# EAGLE design R151D (EAGLE 6.6.0)
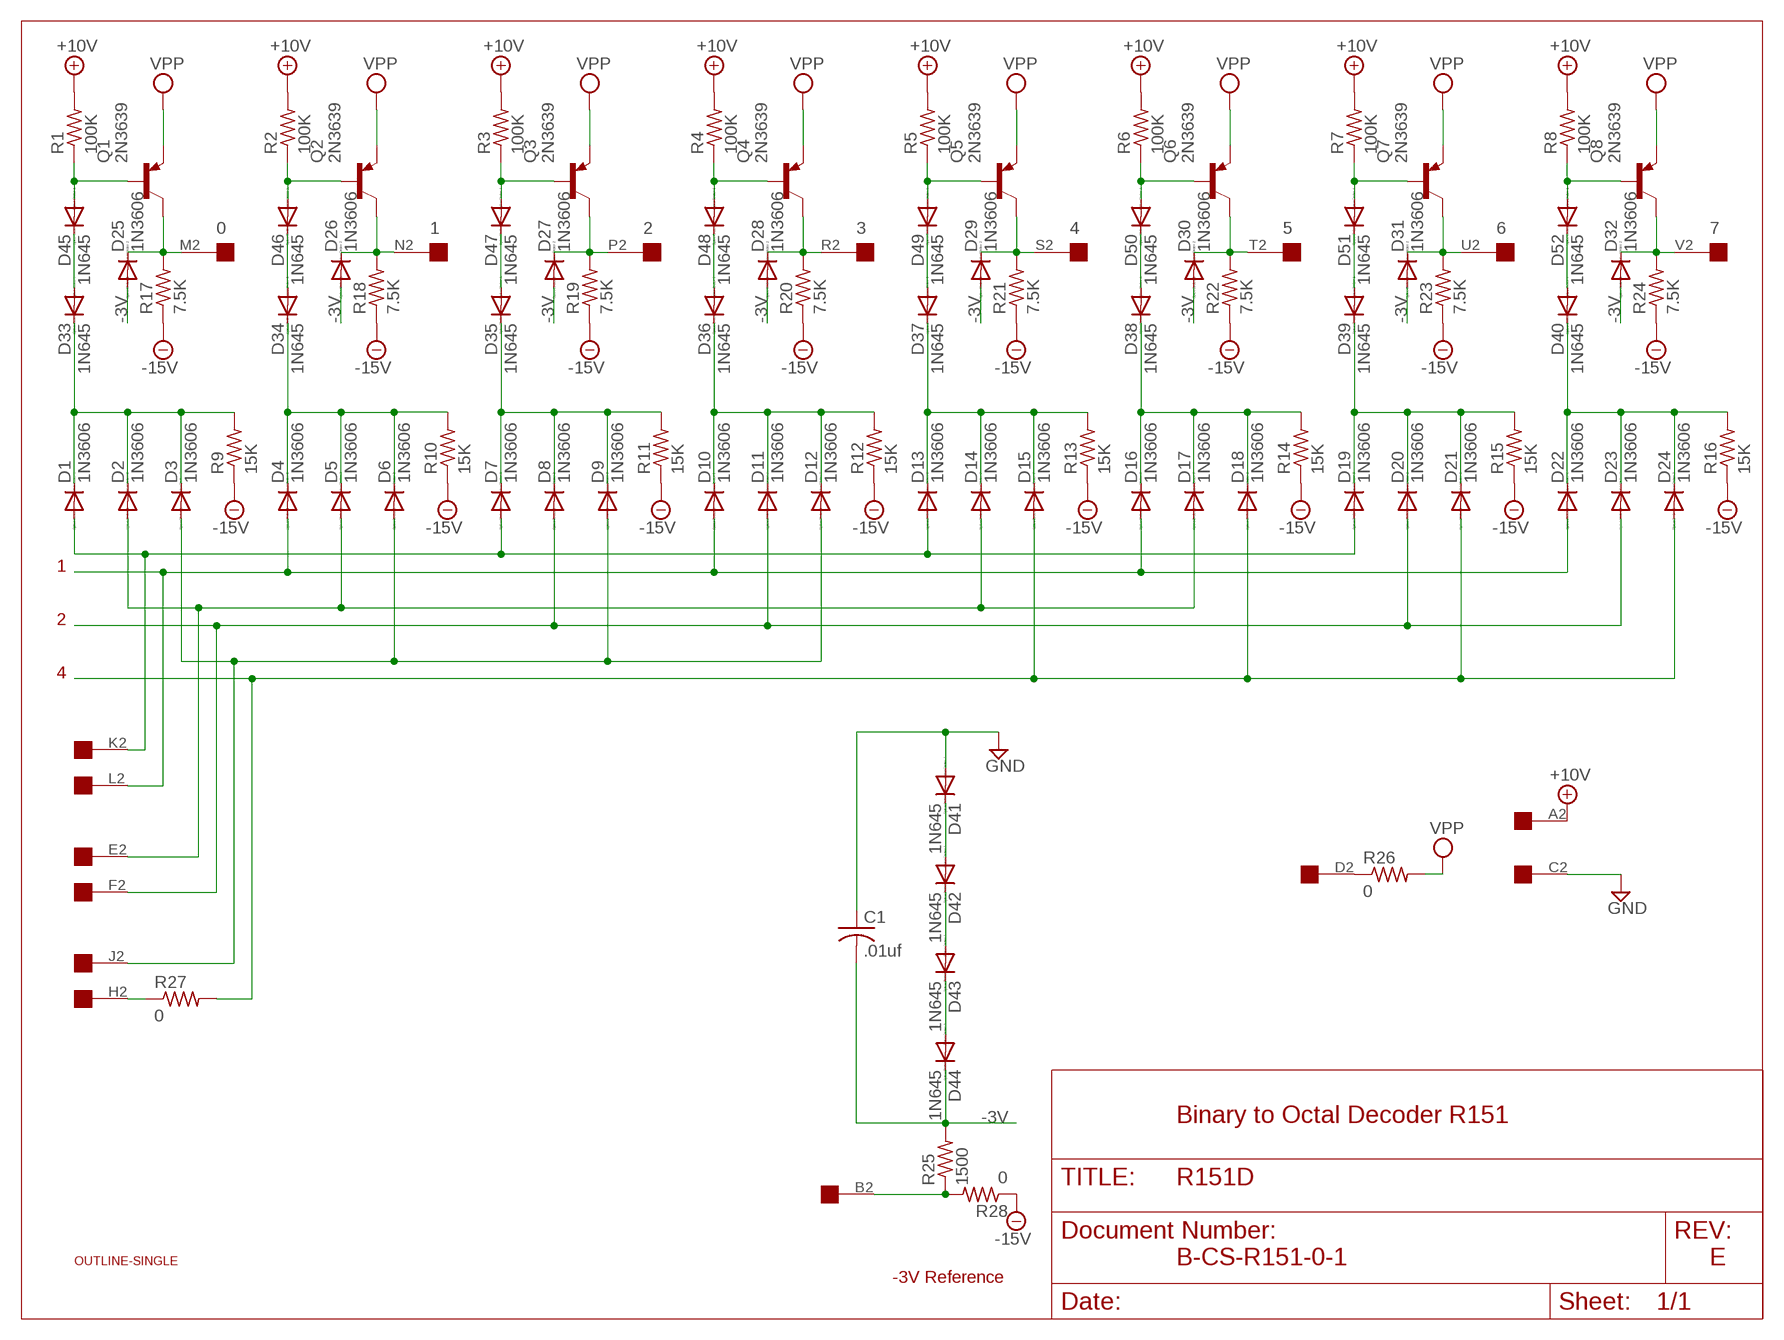
[diagram p0: schematic, sheet 1]

## Parts
C1  .01uf  C-US050-025X075  [C050-025X075]
D1  1N3606  1N4148DO35-10  [DO35-10]
D2  1N3606  1N4148DO35-10  [DO35-10]
D3  1N3606  1N4148DO35-10  [DO35-10]
D4  1N3606  1N4148DO35-10  [DO35-10]
D5  1N3606  1N4148DO35-10  [DO35-10]
D6  1N3606  1N4148DO35-10  [DO35-10]
D7  1N3606  1N4148DO35-10  [DO35-10]
D8  1N3606  1N4148DO35-10  [DO35-10]
D9  1N3606  1N4148DO35-10  [DO35-10]
D10  1N3606  1N4148DO35-10  [DO35-10]
D11  1N3606  1N4148DO35-10  [DO35-10]
D12  1N3606  1N4148DO35-10  [DO35-10]
D13  1N3606  1N4148DO35-10  [DO35-10]
D14  1N3606  1N4148DO35-10  [DO35-10]
D15  1N3606  1N4148DO35-10  [DO35-10]
D16  1N3606  1N4148DO35-10  [DO35-10]
D17  1N3606  1N4148DO35-10  [DO35-10]
D18  1N3606  1N4148DO35-10  [DO35-10]
D19  1N3606  1N4148DO35-10  [DO35-10]
D20  1N3606  1N4148DO35-10  [DO35-10]
D21  1N3606  1N4148DO35-10  [DO35-10]
D22  1N3606  1N4148DO35-10  [DO35-10]
D23  1N3606  1N4148DO35-10  [DO35-10]
D24  1N3606  1N4148DO35-10  [DO35-10]
D25  1N3606  1N4148DO35-10  [DO35-10]
D26  1N3606  1N4148DO35-10  [DO35-10]
D27  1N3606  1N4148DO35-10  [DO35-10]
D28  1N3606  1N4148DO35-10  [DO35-10]
D29  1N3606  1N4148DO35-10  [DO35-10]
D30  1N3606  1N4148DO35-10  [DO35-10]
D31  1N3606  1N4148DO35-10  [DO35-10]
D32  1N3606  1N4148DO35-10  [DO35-10]
D33  1N645  1N4148DO35-10  [DO35-10]
D34  1N645  1N4148DO35-10  [DO35-10]
D35  1N645  1N4148DO35-10  [DO35-10]
D36  1N645  1N4148DO35-10  [DO35-10]
D37  1N645  1N4148DO35-10  [DO35-10]
D38  1N645  1N4148DO35-10  [DO35-10]
D39  1N645  1N4148DO35-10  [DO35-10]
D40  1N645  1N4148DO35-10  [DO35-10]
D41  1N645  1N4148DO35-10  [DO35-10]
D42  1N645  1N4148DO35-10  [DO35-10]
D43  1N645  1N4148DO35-10  [DO35-10]
D44  1N645  1N4148DO35-10  [DO35-10]
D45  1N645  1N4148DO35-10  [DO35-10]
D46  1N645  1N4148DO35-10  [DO35-10]
D47  1N645  1N4148DO35-10  [DO35-10]
D48  1N645  1N4148DO35-10  [DO35-10]
D49  1N645  1N4148DO35-10  [DO35-10]
D50  1N645  1N4148DO35-10  [DO35-10]
D51  1N645  1N4148DO35-10  [DO35-10]
D52  1N645  1N4148DO35-10  [DO35-10]
Q1  2N3639  2N3637  [TO39]
Q2  2N3639  2N3637  [TO39]
Q3  2N3639  2N3637  [TO39]
Q4  2N3639  2N3637  [TO39]
Q5  2N3639  2N3637  [TO39]
Q6  2N3639  2N3637  [TO39]
Q7  2N3639  2N3637  [TO39]
Q8  2N3639  2N3637  [TO39]
R1  100K  R-US_0207/10  [0207/10]
R2  100K  R-US_0207/10  [0207/10]
R3  100K  R-US_0207/10  [0207/10]
R4  100K  R-US_0207/10  [0207/10]
R5  100K  R-US_0207/10  [0207/10]
R6  100K  R-US_0207/10  [0207/10]
R7  100K  R-US_0207/10  [0207/10]
R8  100K  R-US_0207/10  [0207/10]
R9  15K  R-US_0207/10  [0207/10]
R10  15K  R-US_0207/10  [0207/10]
R11  15K  R-US_0207/10  [0207/10]
R12  15K  R-US_0207/10  [0207/10]
R13  15K  R-US_0207/10  [0207/10]
R14  15K  R-US_0207/10  [0207/10]
R15  15K  R-US_0207/10  [0207/10]
R16  15K  R-US_0207/10  [0207/10]
R17  7.5K  R-US_0207/10  [0207/10]
R18  7.5K  R-US_0207/10  [0207/10]
R19  7.5K  R-US_0207/10  [0207/10]
R20  7.5K  R-US_0207/10  [0207/10]
R21  7.5K  R-US_0207/10  [0207/10]
R22  7.5K  R-US_0207/10  [0207/10]
R23  7.5K  R-US_0207/10  [0207/10]
R24  7.5K  R-US_0207/10  [0207/10]
R25  1500  R-US_0207/10  [0207/10]
R26  0  R-US_0207/10  [0207/10]
R27  0  R-US_0207/10  [0207/10]
R28  0  R-US_0207/10  [0207/10]
U$1  OUTLINE-SINGLE  [SINGLE]
U$2  EDGE-1  [EDGE-CON1]

## Nets
0: D25.C Q1.3(C) R17.2 U$2.M2
1: D26.C Q2.3(C) R18.2 U$2.N2
2: D27.C Q3.3(C) R19.2 U$2.P2
3: D28.C Q4.3(C) R20.2 U$2.R2
4: D29.C Q5.3(C) R21.2 U$2.S2
5: D30.C Q6.3(C) R22.2 U$2.T2
6: D31.C Q7.3(C) R23.2 U$2.U2
7: D32.C Q8.3(C) R24.2 U$2.V2
!D0: D1.A D7.A D13.A D19.A U$2.K2
!D1: D2.A D5.A D14.A D17.A U$2.E2
!D2: D3.A D6.A D9.A D12.A U$2.J2
+10V [Power]: R1.2 R2.2 R3.2 R4.2 R5.2 R6.2 R7.2 R8.2 U$2.A2
-3V [Power]: C1.2 D25.A D26.A D27.A D28.A D29.A D30.A D31.A D32.A D44.C R25.2
-15V [Power]: R9.1 R10.1 R11.1 R12.1 R13.1 R14.1 R15.1 R16.1 R17.1 R18.1 R19.1 R20.1 R21.1 R22.1 R23.1 R24.1 R28.1
D0: D4.A D10.A D16.A D22.A U$2.L2
D1: D8.A D11.A D20.A D23.A U$2.F2
D2: D15.A D18.A D21.A D24.A R27.2
GND [Power]: C1.1 D41.A U$2.C2
N$1 [Power]: R25.1 R28.2 U$2.B2
N$2: D46.A Q2.2(B) R2.1
N$3: D41.C D42.A
N$4: R26.1 U$2.D2
N$5: R27.1 U$2.H2
N$6: D4.C D5.C D6.C D34.C R10.2
N$7: D34.A D46.C
N$8: D47.A Q3.2(B) R3.1
N$11: D7.C D8.C D9.C D35.C R11.2
N$12: D35.A D47.C
N$13: D42.C D43.A
N$16: D43.C D44.A
N$18: D48.A Q4.2(B) R4.1
N$19: D45.A Q1.2(B) R1.1
N$22: D1.C D2.C D3.C D33.C R9.2
N$23: D33.A D45.C
N$26: D10.C D11.C D12.C D36.C R12.2
N$27: D36.A D48.C
N$33: D49.A Q5.2(B) R5.1
N$34: D13.C D14.C D15.C D37.C R13.2
N$35: D37.A D49.C
N$36: D50.A Q6.2(B) R6.1
N$37: D16.C D17.C D18.C D38.C R14.2
N$38: D38.A D50.C
N$40: D51.A Q7.2(B) R7.1
N$41: D19.C D20.C D21.C D39.C R15.2
N$42: D39.A D51.C
N$44: D52.A Q8.2(B) R8.1
N$45: D22.C D23.C D24.C D40.C R16.2
N$46: D40.A D52.C
VPP [Power]: Q1.1(E) Q2.1(E) Q3.1(E) Q4.1(E) Q5.1(E) Q6.1(E) Q7.1(E) Q8.1(E) R26.2

## Notes on the sheet
- 1
- 2
- 4
- Binary to Octal Decoder R151
- B-CS-R151-0-1 | E
- -3V Reference

## Library data of the parts
C1 = rcl:C-US: CAPACITOR, American symbol
D1-D52 = diode:1N4148: DIODE high speed (Philips)
Q1-Q8 = transistor-pnp:2N3637*: PNP Transistror
R1-R28 = rcl:R-US_: RESISTOR, American symbol
U$1 = dec-con:OUTLINE-*: Board outlines for DEC boards.
U$2 = dec-con:EDGE-1: Single-Sided DEC Edge Connector -- (side 2)

## Net classes
1 Power: width 0.813 mm

## Board
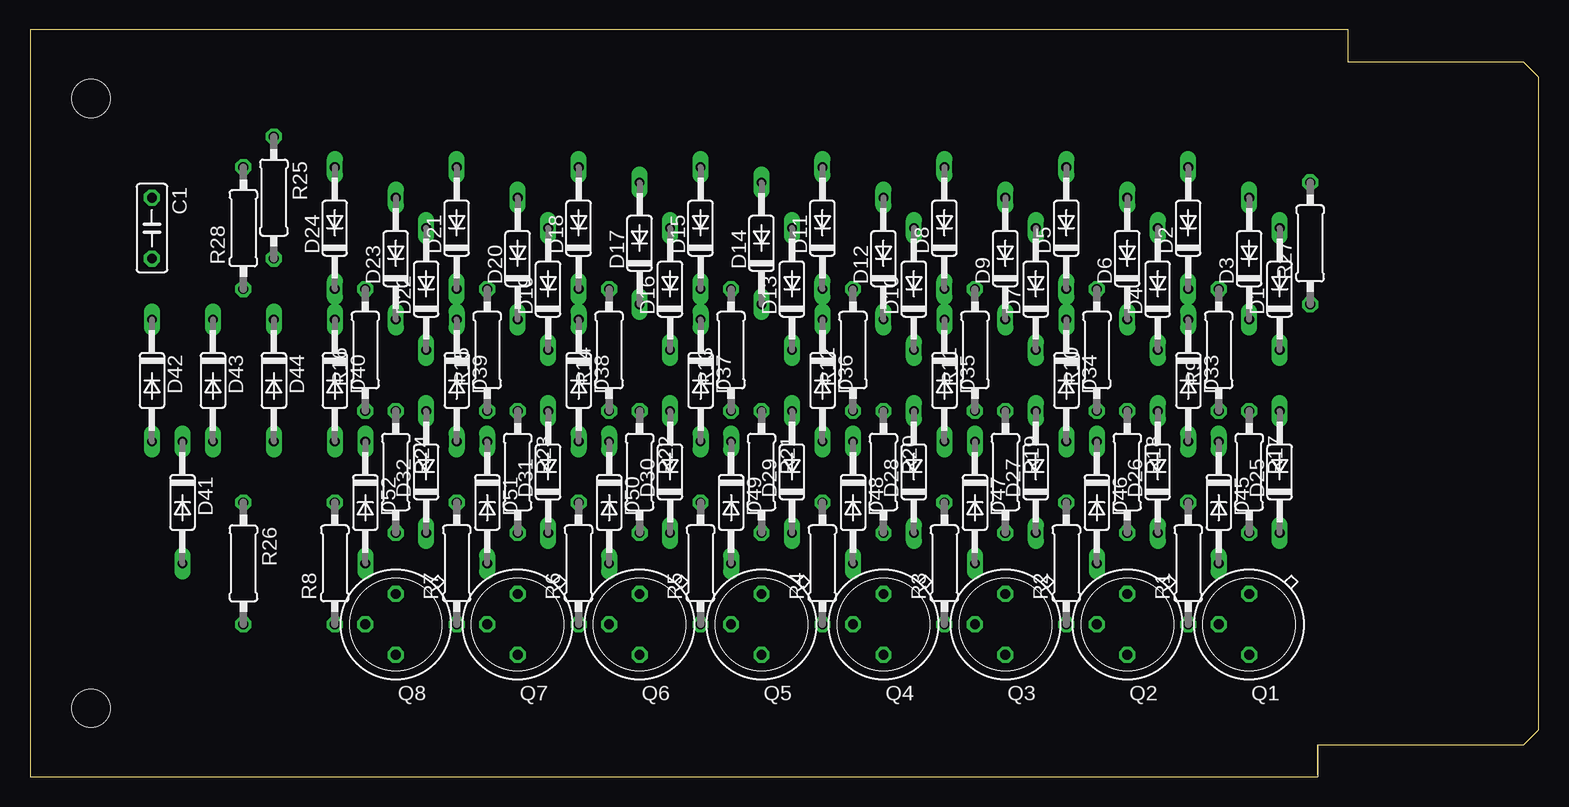
[diagram p1: board, top side]
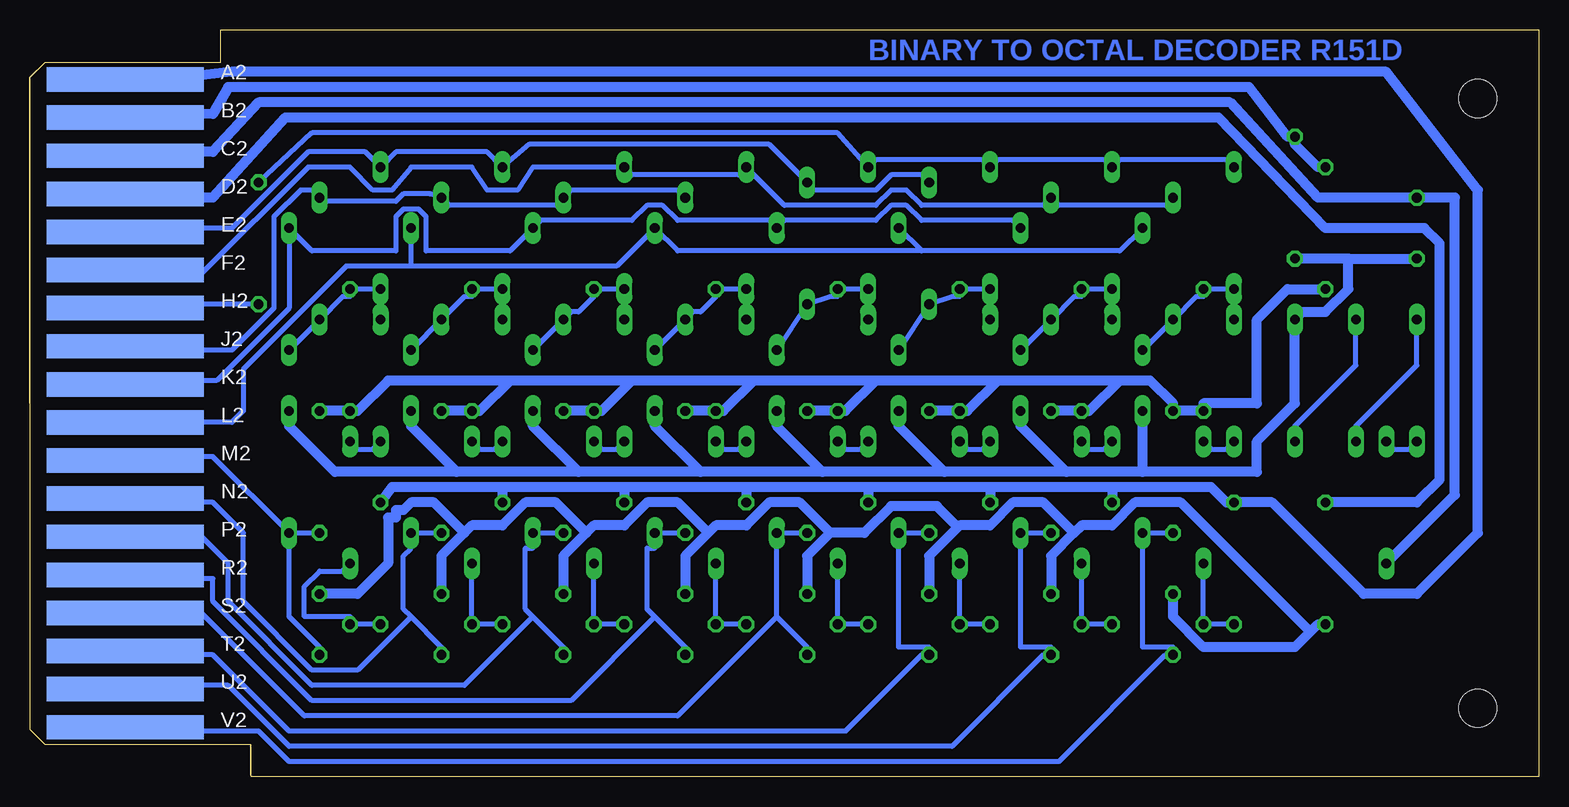
[diagram p2: board, bottom side, seen from below]

Size 125.73 x 62.23 mm. Coordinates in mm from the lower left corner, seen from the top.
Copper layers (1+16): Top 0.035mm / dielectric 1.5mm / Bottom 0.035mm
Design rules "16mils": minimum track width 16mil, minimum drill 32mil, track to track 15mil, track to pad 10mil, pad to pad 10mil, via to via 10mil, smd to smd 10mil, copper to edge 13mil, drill to drill 10mil, minimum pad ring 10mil, minimum via ring 8mil, stop-mask expansion 0mil, vias tented up to drill 0mil, thermal gap 10mil

### Footprints (pad centres in the part's own frame; a part is rotated, then mirrored left to right if it is on the bottom)
C050-025X075 = drill 0.813 octagon: 1 -2.54,0; 2 2.54,0
DO35-10 = drill 0.813 long: A 5.08,0; C -5.08,0
TO39 = drill 0.813 octagon: 1 0,-2.54; 2 2.54,0; 3 0,2.54
0207/10 = drill 0.813 octagon: 1 -5.08,0; 2 5.08,0
SINGLE = hole 3.175: 120.65,56.515; 120.65,5.715
EDGE-CON1 = smd 13.106 x 2.032 bottom: A2 7.938,4.128; B2 7.938,7.303; C2 7.938,10.477; D2 7.938,13.652; E2 7.938,16.828; F2 7.938,20.003; H2 7.938,23.177; J2 7.938,26.352; K2 7.938,29.527; L2 7.938,32.703; M2 7.938,35.877; N2 7.938,39.053; P2 7.938,42.227; R2 7.938,45.403; S2 7.938,48.578; T2 7.938,51.752; U2 7.938,54.928; V2 7.938,58.102

### Placement (x,y rotation side)
C1  10.16,45.72 270 top
D1  104.14,40.64 90 top
D2  96.52,45.72 90 top
D3  101.6,43.18 90 top
D4  93.98,40.64 90 top
D5  86.36,45.72 90 top
D6  91.44,43.18 90 top
D7  83.82,40.64 90 top
D8  76.2,45.72 90 top
D9  81.28,43.18 90 top
D10  73.66,40.64 90 top
D11  66.04,45.72 90 top
D12  71.12,43.18 90 top
D13  63.5,40.64 90 top
D14  60.96,44.45 90 top
D15  55.88,45.72 90 top
D16  53.34,40.64 90 top
D17  50.8,44.45 90 top
D18  45.72,45.72 90 top
D19  43.18,40.64 90 top
D20  40.64,43.18 90 top
D21  35.56,45.72 90 top
D22  33.02,40.64 90 top
D23  30.48,43.18 90 top
D24  25.4,45.72 90 top
D25  104.14,25.4 90 top
D26  93.98,25.4 90 top
D27  83.82,25.4 90 top
D28  73.66,25.4 90 top
D29  63.5,25.4 90 top
D30  53.34,25.4 90 top
D31  43.18,25.4 90 top
D32  33.02,25.4 90 top
D33  96.52,33.02 270 top
D34  86.36,33.02 270 top
D35  76.2,33.02 270 top
D36  66.04,33.02 270 top
D37  55.88,33.02 270 top
D38  45.72,33.02 270 top
D39  35.56,33.02 270 top
D40  25.4,33.02 270 top
D41  12.7,22.86 270 top
D42  10.16,33.02 270 top
D43  15.24,33.02 270 top
D44  20.32,33.02 270 top
D45  99.06,22.86 270 top
D46  88.9,22.86 270 top
D47  78.74,22.86 270 top
D48  68.58,22.86 270 top
D49  58.42,22.86 270 top
D50  48.26,22.86 270 top
D51  38.1,22.86 270 top
D52  27.94,22.86 270 top
Q1  101.6,12.7 180 top
Q2  91.44,12.7 180 top
Q3  81.28,12.7 180 top
Q4  71.12,12.7 180 top
Q5  60.96,12.7 180 top
Q6  50.8,12.7 180 top
Q7  40.64,12.7 180 top
Q8  30.48,12.7 180 top
R1  96.52,17.78 90 top
R2  86.36,17.78 90 top
R3  76.2,17.78 90 top
R4  66.04,17.78 90 top
R5  55.88,17.78 90 top
R6  45.72,17.78 90 top
R7  35.56,17.78 90 top
R8  25.4,17.78 90 top
R9  99.06,35.56 90 top
R10  88.9,35.56 90 top
R11  78.74,35.56 90 top
R12  68.58,35.56 90 top
R13  58.42,35.56 90 top
R14  48.26,35.56 90 top
R15  38.1,35.56 90 top
R16  27.94,35.56 90 top
R17  101.6,25.4 270 top
R18  91.44,25.4 270 top
R19  81.28,25.4 270 top
R20  71.12,25.4 270 top
R21  60.96,25.4 270 top
R22  50.8,25.4 270 top
R23  40.64,25.4 270 top
R24  30.48,25.4 270 top
R25  20.32,48.26 270 top
R26  17.78,17.78 270 top
R27  106.68,44.45 90 top
R28  17.78,45.72 90 top
U$1  125.73,62.23 180 top
U$2  125.73,62.23 180 top

### Tracks (layer width: path | path; a pad name or v marks a point on that pad's centre or on a via)
0
  Bottom 0.406: Q1.3 101.6,10.79 104.14,13.34 D25.C | D25.C R17.2 | D25.C 110.49,26.67 113.03,26.67 U$2.M2
1
  Bottom 0.406: 93.98,13.34 94.61,13.97 94.61,18.41 93.98,19.05 D26.C R18.2 | 93.98,13.34 91.44,10.79 Q2.3 | 93.98,13.34 98.42,8.89 102.23,8.89 107.95,14.61 107.95,20.32 110.49,22.86 111.76,22.86 U$2.N2
2
  Bottom 0.406: 83.82,13.34 84.45,13.97 84.45,19.05 83.82,19.05 D27.C R19.2 | 83.82,13.34 81.28,10.79 Q3.3 | 83.82,13.34 89.53,7.62 102.23,7.62 109.22,14.61 109.22,17.78 111.76,20.32 U$2.P2
3
  Bottom 0.406: 73.66,13.34 74.3,13.97 74.3,19.05 73.66,19.05 D28.C R20.2 | 73.66,13.34 71.12,10.79 Q4.3 | 73.66,13.34 80.64,6.35 102.23,6.35 110.49,14.61 110.49,16.51 111.76,16.51 U$2.R2
4
  Bottom 0.406: 63.5,13.34 60.96,10.79 Q5.3 | 63.5,13.34 D29.C R21.2 | 63.5,13.34 71.75,5.08 102.87,5.08 111.76,13.97 U$2.S2
5
  Bottom 0.406: U$2.T2 112.39,10.16 110.49,10.16 104.14,3.81 57.78,3.81 51.44,10.16 Q6.3 50.8,10.79 53.34,10.79 D30.C R22.2
6
  Bottom 0.406: R23.2 D31.C 43.18,10.79 40.64,10.79 Q7.3 41.27,10.16 48.9,2.54 104.14,2.54 109.22,7.62 113.03,7.62 U$2.U2
7
  Bottom 0.406: R24.2 D32.C 33.02,10.79 30.48,10.79 Q8.3 31.11,10.16 40.01,1.27 104.14,1.27 106.68,3.81 111.76,3.81 U$2.V2
!D0
  Bottom 0.406: U$2.K2 111.76,33.02 110.17,33.02 104.14,39.05 D1.A 102.23,43.81 95.25,43.81 95.25,46.67 94.61,47.31 93.34,47.31 92.71,46.67 92.71,43.81 85.72,43.81 D7.A 83.19,46.35 75.56,46.35 74.3,47.62 73.03,47.62 71.75,46.35 64.14,46.35 D13.A 62.87,46.35 55.24,46.35 53.98,47.62 52.7,47.62 51.44,46.35 43.81,46.35 D19.A
!D1
  Bottom 0.406: U$2.E2 111.76,45.72 108.9,45.72 102.55,52.07 97.79,52.07 D2.A 95.25,52.07 87.63,52.07 D5.A 84.14,52.7 64.14,52.7 D14.A 60.33,48.9 55.24,48.9 53.98,50.16 51.44,50.16 D17.A
!D2
  Bottom 0.406: D12.A 71.75,48.9 80.64,48.9 D9.A 81.92,47.62 90.81,47.62 D6.A 92.39,48.58 94.61,48.58 95.25,47.94 100.97,47.94 D3.A 102.23,48.9 103.19,48.9 105.41,46.67 105.41,39.05 108.9,35.56 113.35,35.56 U$2.J2
+10V
  Bottom 0.813: 66.04,24.13 76.2,24.13 | 76.2,24.13 86.36,24.13 | 76.2,24.13 R3.2 | R1.2 95.57,24.13 86.36,24.13 | 86.36,24.13 R2.2 | U$2.A2 111.76,58.42 108.9,58.74 12.7,58.74 5.08,48.9 5.08,20.32 10.16,15.24 14.61,15.24 22.23,22.86 R8.2 26.04,22.86 27.3,24.13 35.56,24.13 | 35.56,24.13 45.72,24.13 | 45.72,24.13 55.88,24.13 | 55.88,24.13 66.04,24.13 | 35.56,24.13 R7.2 | 66.04,24.13 R4.2 | 45.72,24.13 R6.2 | 55.88,24.13 R5.2
-3V
  Bottom 0.813: 15.88,43.18 C1.2 | 15.88,43.18 R25.2 | 33.02,25.4 39.37,25.4 | 39.37,25.4 43.18,29.21 D31.A | 33.02,25.4 D32.A | 49.53,25.4 53.34,29.21 D30.A | 39.37,25.4 49.53,25.4 | 59.69,25.4 63.5,29.21 D29.A | 49.53,25.4 59.69,25.4 | 69.85,25.4 73.66,29.21 D28.A | 59.69,25.4 69.85,25.4 | 80.01,25.4 83.82,29.21 D27.A | 69.85,25.4 80.01,25.4 | 90.17,25.4 93.98,29.21 D26.A | 80.01,25.4 90.17,25.4 | 90.17,25.4 100.33,25.4 104.14,29.21 D25.A | 33.02,25.4 23.5,25.4 23.5,27.94 20.32,31.11 D44.C 19.68,38.73 17.78,38.73 15.88,40.64 15.88,43.18
-15V
  Bottom 0.813: R17.1 R9.1 98.42,30.48 95.89,33.02 85.72,33.02 | R18.1 R10.1 88.27,30.48 85.72,33.02 | R19.1 R11.1 78.11,30.48 75.56,33.02 | R20.1 R12.1 67.94,30.48 65.41,33.02 | R21.1 R13.1 57.78,30.48 55.24,33.02 | R22.1 R14.1 47.62,30.48 45.09,33.02 | R23.1 R15.1 37.47,30.48 34.92,33.02 | 34.92,33.02 32.38,33.02 30.48,31.11 R24.1 R16.1 27.94,31.11 23.5,31.11 23.5,38.1 20.95,40.64 R28.1 | 34.92,33.02 45.09,33.02 | 45.09,33.02 55.24,33.02 | 55.24,33.02 65.41,33.02 | 65.41,33.02 75.56,33.02 | 75.56,33.02 85.72,33.02
D0
  Bottom 0.406: 51.44,43.81 34.92,43.81 D22.A | 51.44,43.81 D16.A | 51.44,43.81 71.75,43.81 D10.A 76.83,42.55 93.98,42.55 | 93.98,42.55 99.38,42.55 107.95,33.97 107.95,30.48 108.9,29.53 111.44,29.53 111.76,29.21 U$2.L2 | 93.98,42.55 D4.A
D1
  Bottom 0.406: U$2.F2 118.11,41.91 111.44,41.91 102.55,50.8 99.06,50.8 97.16,48.9 95.57,48.9 93.98,50.8 88.9,50.8 87.63,48.9 85.09,48.9 83.82,50.8 D8.A 75.56,50.16 66.67,50.16 D11.A 62.87,47.62 55.24,47.62 53.98,48.9 52.7,48.9 51.44,47.62 41.27,47.62 D20.A 40.01,47.62 31.11,47.62 D23.A
D2
  Bottom 0.406: D24.A 26.04,51.44 34.92,51.44 D21.A 36.2,51.44 45.09,51.44 D18.A 46.35,51.44 55.24,51.44 D15.A 58.42,53.66 102.23,53.66 R27.2
GND
  Bottom 0.813: D41.A 6.99,23.5 6.99,48.26 C1.1 18.41,48.26 25.72,56.2 106.68,56.2 110.49,52.07 118.11,52.07 118.11,51.74 U$2.C2
N$1
  Bottom 0.813: U$2.B2 110.49,55.24 109.22,57.47 24.13,57.47 20.95,53.34 R25.1 20.32,52.7 18.41,50.8 R28.2
N$2
  Bottom 0.406: R2.1 Q2.2 D46.A
N$3
  Bottom 0.406: D42.A 10.79,27.3 12.06,27.3 D41.C
N$4
  Bottom 0.813: R26.1 10.16,22.86 8.26,24.77 8.26,44.45 9.53,45.72 17.78,45.72 26.67,54.93 104.46,54.93 110.49,48.26 117.73,48.26 U$2.D2
N$5
  Bottom 0.406: R27.1 111.76,39.37 U$2.H2
N$6
  Bottom 0.406: D4.C D6.C 89.53,40.01 88.9,40.01 R10.2 D5.C D34.C
N$7
  Bottom 0.406: D34.A 87,27.3 88.27,27.3 D46.C
N$8
  Bottom 0.406: R3.1 Q3.2 D47.A
N$11
  Bottom 0.406: D35.C D8.C R11.2 78.74,40.01 80.01,38.73 80.64,38.73 D9.C D7.C
N$12
  Bottom 0.406: D35.A 76.83,27.3 78.11,27.3 D47.C
N$13
  Bottom 0.406: D43.A 15.24,29.21 10.16,34.29 D42.C
N$16
  Bottom 0.406: D44.A 20.32,29.21 15.24,34.29 D43.C
N$18
  Bottom 0.406: R4.1 Q4.2 D48.A
N$19
  Bottom 0.406: R1.1 Q1.2 99.06,13.34 102.87,13.34 102.87,15.88 101.6,17.14 99.69,17.14 D45.A
N$22
  Bottom 0.406: D1.C D3.C 99.69,40.01 99.06,40.01 R9.2 D2.C D33.C
N$23
  Bottom 0.406: D33.A 97.16,27.3 98.42,27.3 D45.C
N$26
  Bottom 0.406: D36.C D11.C R12.2 68.58,40.01 69.85,38.73 70.48,38.73 D12.C D10.C
N$27
  Bottom 0.406: D36.A 66.67,27.3 67.94,27.3 D48.C
N$33
  Bottom 0.406: R5.1 Q5.2 D49.A
N$34
  Bottom 0.406: D13.C D14.C 59.05,40.01 58.42,40.01 R13.2 D15.C D37.C
N$35
  Bottom 0.406: D37.A 56.52,27.3 57.78,27.3 D49.C
N$36
  Bottom 0.406: R6.1 Q6.2 D50.A
N$37
  Bottom 0.406: D16.C D17.C 48.9,40.01 48.26,40.01 R14.2 D18.C D38.C
N$38
  Bottom 0.406: D38.A 46.35,27.3 47.62,27.3 D50.C
N$40
  Bottom 0.406: R7.1 Q7.2 D51.A
N$41
  Bottom 0.406: D19.C D20.C 38.73,40.01 38.1,40.01 R15.2 D21.C D39.C
N$42
  Bottom 0.406: D39.A 36.2,27.3 37.47,27.3 D51.C
N$44
  Bottom 0.406: R8.1 Q8.2 D52.A
N$45
  Bottom 0.406: D22.C D23.C 28.57,40.01 27.94,40.01 R16.2 D24.C D40.C
N$46
  Bottom 0.406: D40.A 26.04,27.3 27.3,27.3 D52.C
VPP
  Bottom 0.813: 19.05,12.06 20.32,10.79 27.94,10.79 30.48,13.34 Q8.1 | 19.05,12.06 18.41,12.7 R26.2 | 38.73,20.32 38.1,20.95 35.56,20.95 33.66,22.86 29.84,22.86 19.05,12.06 | 38.73,20.32 40.64,18.41 Q7.1 | 48.42,20.8 48.26,20.95 45.72,20.95 43.81,22.86 41.27,22.86 38.73,20.32 | 48.42,20.8 50.8,18.41 Q6.1 | Q5.1 60.96,18.41 59.05,20.32 | 59.05,20.32 56.2,20.32 53.98,22.54 50.16,22.54 48.42,20.8 | 48.42,20.8 | 69.22,20.32 68.58,20.95 66.04,20.95 64.14,22.86 61.59,22.86 59.05,20.32 | 69.22,20.32 71.12,18.41 Q4.1 | 79.38,20.32 78.74,20.95 76.2,20.95 74.3,22.86 71.75,22.86 69.22,20.32 | 79.38,20.32 81.28,18.41 Q3.1 | 89.53,20.32 88.9,20.95 86.36,20.95 84.45,22.86 81.92,22.86 79.38,20.32 | 89.53,20.32 91.44,18.41 Q2.1 | 89.53,20.32 92.08,22.86 93.98,22.86 94.61,22.23 95.25,22.23 95.25,21.59 95.89,21.59 95.89,17.78 98.42,15.24 Q1.1

### Text on the board
Bottom: BINARY TO OCTAL DECODER R151D